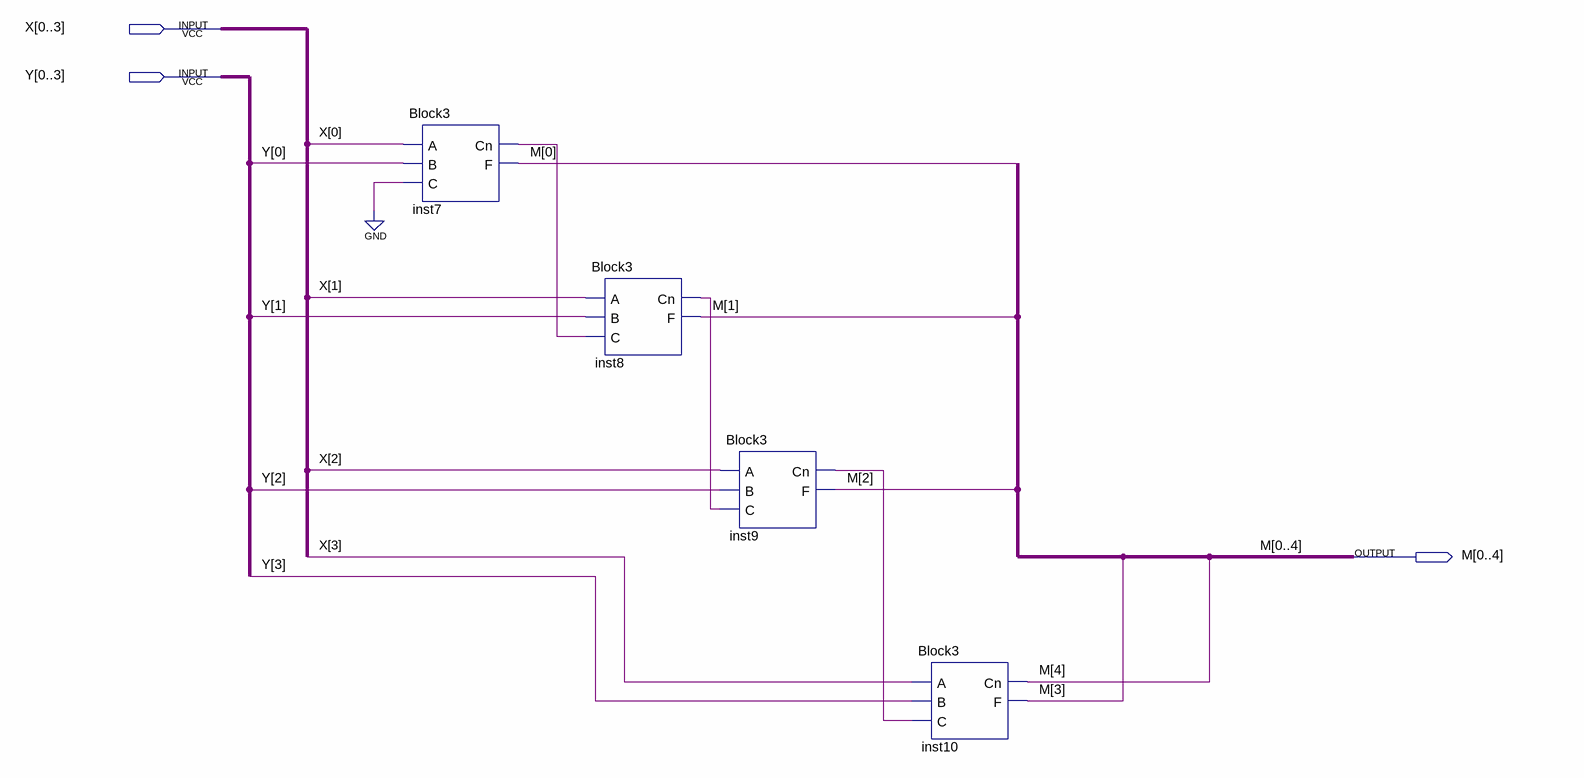
[diagram p0: schematic sheet]
// Quartus schematic Somador4bits.bdf as structural Verilog: 4 symbols, 3 pins
module Somador4bits (
  input  [0:3] X,
  input  [0:3] Y,
  output [0:4] M
);

  wire inst7_cn, inst8_cn, inst9_cn;

  Block3 inst7 (.A(X[0]), .B(Y[0]), .C(1'b0), .Cn(inst7_cn), .F(M[0]));
  Block3 inst8 (.A(X[1]), .B(Y[1]), .C(inst7_cn), .Cn(inst8_cn), .F(M[1]));
  Block3 inst9 (.A(X[2]), .B(Y[2]), .C(inst8_cn), .Cn(inst9_cn), .F(M[2]));
  Block3 inst10 (.A(X[3]), .B(Y[3]), .C(inst9_cn), .Cn(M[4]), .F(M[3]));
endmodule
